# Altium schematic sheet [Master]ESP32WROOM.SchDoc: AC
size A4; Author: Nguyen Huu Nghia; CompanyName: MAT; Organization: AD20; Address1: x; Address2: x; Address3: x; Address4: x; DocumentNumber: 1; Revision: V1.0; SheetNumber: 1; SheetTotal: 1
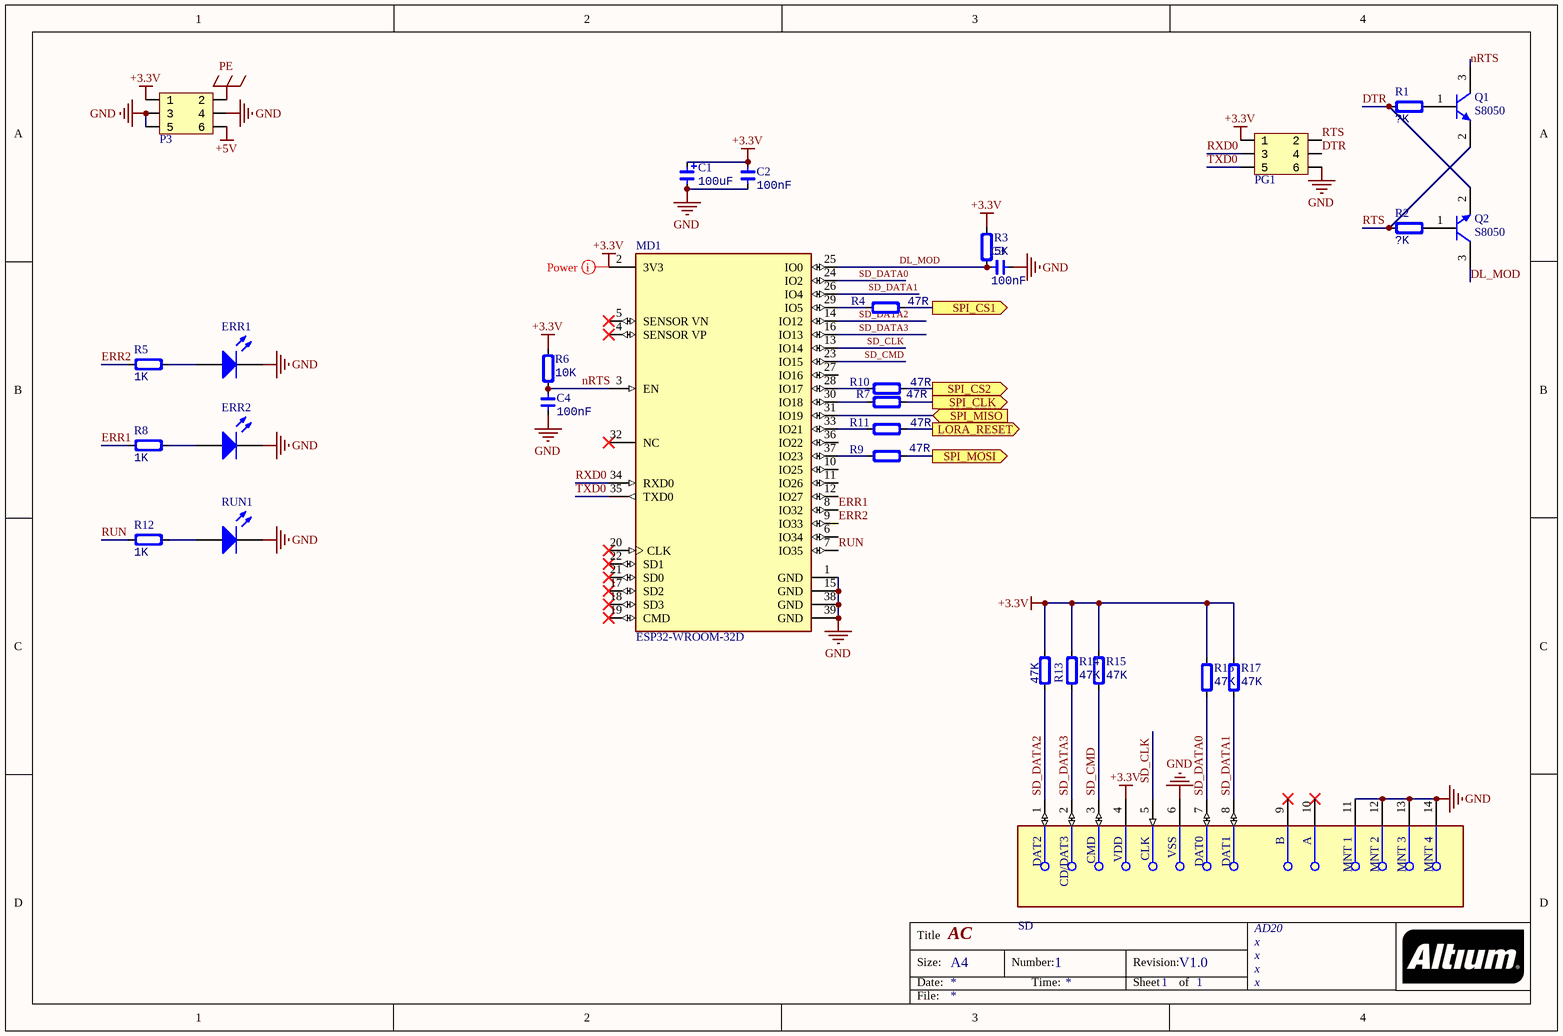
[diagram p0: [Master]ESP32WROOM.SchDoc]

## Parts
C1  value 100uF  [CAP_TAN_1206]  (hidden comment: C1206)
C2  value 100nF  [CAP-0805]  (hidden comment: Cap_0805)
C3  value 100nF  [CAP-0603]  (hidden comment: Cap_0603)
C4  value 100nF  [CAP-0603]  (hidden comment: Cap_0603)
ERR1  150080YS75000  [0805_A]  (value not drawn)
ERR2  150080YS75000  [0805_A]  (value not drawn)
MD1  ESP32-WROOM-32D  [FP-ESP32-WROOM-32D-MFG]
P3  HDR2x3  [HDR2X3_2.54_90F]  (value not drawn)
PG1  HDR2x3  [HDR2X3_2.54_90F]  (value not drawn)
Q1  S8050  [ONSC-SOT-23-3-318-08_V]
Q2  S8050  [ONSC-SOT-23-3-318-08_V]
R1  value ?K  [RES-0805]  (hidden comment: R0805)
R2  value ?K  [RES-0805]  (hidden comment: R0805)
R3  value 5K  [RES-0805]  (hidden comment: R0805)
R4  value 47R  [RES-0805]  (hidden comment: R0805)
R5  value 1K  [RES-0805]  (hidden comment: R0805)
R6  value 10K  [RES-0805]  (hidden comment: R0805)
R7  value 47R  [RES-0805]  (hidden comment: R0805)
R8  value 1K  [RES-0805]  (hidden comment: R0805)
R9  value 47R  [RES-0805]  (hidden comment: R0805)
R10  value 47R  [RES-0805]  (hidden comment: R0805)
R11  value 47R  [RES-0805]  (hidden comment: R0805)
R12  value 1K  [RES-0805]  (hidden comment: R0805)
R13  value 47K  [RES-0805]  (hidden comment: R0805)
R14  value 47K  [RES-0805]  (hidden comment: R0805)
R15  value 47K  [RES-0805]  (hidden comment: R0805)
R16  value 47K  [RES-0805]  (hidden comment: R0805)
R17  value 47K  [RES-0805]  (hidden comment: R0805)
RUN1  150080YS75000  [0805_A]  (value not drawn)
SD  DM3AT-SF-PEJM5(11)  [FP-DM3AT-SF-PEJM5_11-MFG]  (value not drawn)

## Ports
LORA_RESET (out), SPI_CLK (out), SPI_CS1 (out), SPI_CS2 (out), SPI_MISO (in), SPI_MOSI (out)

## Nets
+3.3V: C1.1 C2.2 MD1.2(3V3) P3.1 PG1.1 R3.1 R6.1 R13.1 R14.1 R15.1 R16.1 R17.1 SD.4(VDD)
+5V: P3.6
GND: C1.2 C2.1 C3.1 C4.1 ERR1.1(K) ERR2.1(K) MD1.1(GND) MD1.15(GND) MD1.38(GND) MD1.39(GND) P3.3 P3.4 P3.5 PG1.6 RUN1.1(K) SD.6(VSS) SD.11(MNT_1) SD.12(MNT_2) SD.13(MNT_3) SD.14(MNT_4)
PE: P3.2
DL_MOD: C3.2 MD1.25(IO0) Q2.3(C) R3.2
DTR: PG1.4 Q2.2(E) R1.1
ERR1: MD1.8(IO32) R8.2
ERR2: MD1.9(IO33) R5.2
LORA_RESET: R11.2 ; port LORA_RESET
nRTS: C4.2 MD1.3(EN) Q1.3(C) R6.2
RTS: PG1.2 Q1.2(E) R2.1
RUN: MD1.7(IO35) R12.2
RXD0: MD1.34(RXD0) PG1.3
SD_CLK: MD1.13(IO14) SD.5(CLK)
SD_CMD: MD1.23(IO15) R15.2 SD.3(CMD)
SD_DATA0: MD1.24(IO2) R16.2 SD.7(DAT0)
SD_DATA1: MD1.26(IO4) R17.2 SD.8(DAT1)
SD_DATA2: MD1.14(IO12) R13.2 SD.1(DAT2)
SD_DATA3: MD1.16(IO13) R14.2 SD.2(CD/DAT3)
SPI_CLK: R7.2 ; port SPI_CLK
SPI_CS1: R4.2 ; port SPI_CS1
SPI_CS2: R10.2 ; port SPI_CS2
SPI_MISO: MD1.31(IO19) ; port SPI_MISO
SPI_MOSI: R9.2 ; port SPI_MOSI
TXD0: MD1.35(TXD0) PG1.5
NetERR1_2: ERR1.2(A) R5.1
NetERR2_2: ERR2.2(A) R8.1
NetMD1_28: MD1.28(IO17) R10.1
NetMD1_29: MD1.29(IO5) R4.1
NetMD1_30: MD1.30(IO18) R7.1
NetMD1_33: MD1.33(IO21) R11.1
NetMD1_37: MD1.37(IO23) R9.1
NetQ1_1: Q1.1(B) R1.2
NetQ2_1: Q2.1(B) R2.2
NetR12_1: R12.1 RUN1.2(A)

Not connected (* = marked no-connect by the designer): MD1 4(SENSOR_VP)* 5(SENSOR_VN)* 6(IO34) 10(IO25) 11(IO26) 12(IO27) 17(SD2)* 18(SD3)* 19(CMD)* 20(CLK)* 21(SD0)* 22(SD1)* 27(IO16) 32(NC)* 36(IO22); SD 9(B)* 10(A)*

## Layout directives
mark named Power: +3.3V

## Notes on the sheet
- Title
- Size:
- Date:
- A4
- Number:
- Time:
- Revision:
- Sheet
- of
- File:

## Library data of the parts
C1 = Cap_Tan_1206: Capacitor Tantalum; Manufacturer: *; Note: *
C2 = Cap_0805: Capacitor; Manufacturer: *
C3 C4 = Cap_0603: Capacitor; Manufacturer: *
ERR1 ERR2 RUN1 = CMP-1426-00012-1: SMD mono-color Chip LED, WL-SMCW, Yellow; Manufacturer: Wuerth Elektronik; Color: Yellow; ComponentLink1URL: http://www.we-online.com; PackageReference: 0805_A; ComponentLink2URL: http://katalog.we-online.com/led/datasheet/150080YS75000.pdf; ComponentLink1Description: Manufacturer URL; ComponentLink2Description: Datasheet; PartNumber: 150080YS75000
MD1 = CMP-194065-000003-1: WIFI MODULE 32MBITS SPI FLASH; Manufacturer: Espressif Systems; Max Supply Voltage: 3.6V; Nominal Supply Current: 500mA; Max Frequency: 2484MHz; Number Of Adc Channels: 16; Number Of Gpio: 32; Interface: I2C,SPI,UART,Ethernet,I2S,Other; Data Rate: 150Mbits/s; Min Supply Voltage: 3V; Bandwidth: 72MHz; Sensitivity: -98dBm; Octopart: https://octopart.com/esp32-wroom-32d-espressif+systems-91040050; Package: ESP32-WROOM-32D; ComponentLink2URL: https://www.espressif.com/sites/default/files/documentation/esp32-wroom-32d_esp32-wroom-32u_datasheet_en.pdf; Lead Free: Yes; Category: UNK; Mouser Description: Wi-Fi/BT BLE Module ESP32-D0WD, SPI Flash, UART, P; Device Class L1: Integrated Circuits (ICs); RoHS: TRUE; Temperature Range Low: -40°C; ComponentLink2Description: Datasheet; Digikey Description: WIFI MODULE 32MBITS SPI FLASH; Height: 3.2mm; Temperature: -40°C to +85°C; Manufacturer Part Number: ESP32-WROOM-32D; Device Class L3: Transceivers; Device Class L2: RF Semiconductors and Devices; Temperature Range High: +85°C; Automotive: No
P3 PG1 = HDR2x3_2.54: Header
Q1 Q2 = CMP-1048-00662-1: High Voltage Transistor, NPN Silicon, 3-Pin SOT-23, Pb-Free, Tape and Reel; PartNumber: MMBTA42LT1G; Manufacturer: On Semiconductor; fT Min (MHz): 50; IC Continuous (A): 0.5; ComponentLink1URL: http://www.onsemi.com/; ComponentLink3URL: http://www.onsemi.cn/pub_link/Collateral/318-08.PDF; RoHS: TRUE; ComponentLink2Description: Datasheet; Polarity: NPN; DatasheetVersion: Rev. 12; PackageReference: SOT-23-3-318-08; PackageDescription: 3-Pin Small Outline Transistor, Body 2.92 x 1.3 mm, Pitch 0.95 mm; ComponentLink3Description: Package Specification; ComponentLink1Description: Manufacturer URL; Packing: Tape and Reel; PackageVersion: Rev. AP, 11/2009; Mounting Technology: Surface Mount; ComponentLink2URL: http://www.onsemi.cn/pub_link/Collateral/MMBTA42LT1-D.PDF
R1-R17 = Res_0805: Resistor; Manufacturer: *
SD = MicroSDCARD: CONN MICRO SD R/A PUSH-PUSH SMD; Manufacturer: Hirose; Number Of Contacts: 8; Current Rating: 0.5A; Shielding: true; Conn Orientation: Right Angle; Voltage Rating: 125V; Is Female: yes; Pitch: 1.1mm; Footprint Url: https://www.hirose.com/product/document?clcode=CL0609-0031-0-00&productname=DM3AT-SF-PEJM5&series=DM3&documenttype=2DDrawing&lang=en&documentid=0000947170; Temperature: -25°C to +85°C; Device Class L2: Memory Connectors; Device Class L1: Connectors; Device Class L3: unset; Temperature Range High: +85°C; Package: 0; Contact Material: Gold; Automotive: No; Mouser Description: Memory Card Connectors 8P R/A SMT MICRO SD PUSH-PUSH; Category: Conn; ComponentLink2URL: https://www.hirose.com/product/document?clcode=CL0609-0033-6-00&productname=DM3AT-SF-PEJ2M5&series=DM3&documenttype=Catalog&lang=en&documentid=D49662_en; Temperature Range Low: -25°C; RoHS: TRUE; ComponentLink2Description: Datasheet; Manufacturer Part Number: DM3AT-SF-PEJM5(11); Height: 1.83mm; Digikey Description: CONN MICRO SD R/A PUSH-PUSH SMD; Lead Free: Yes; Octopart: https://octopart.com/dm3at-sf-pejm5%2811%29-hirose-29719365